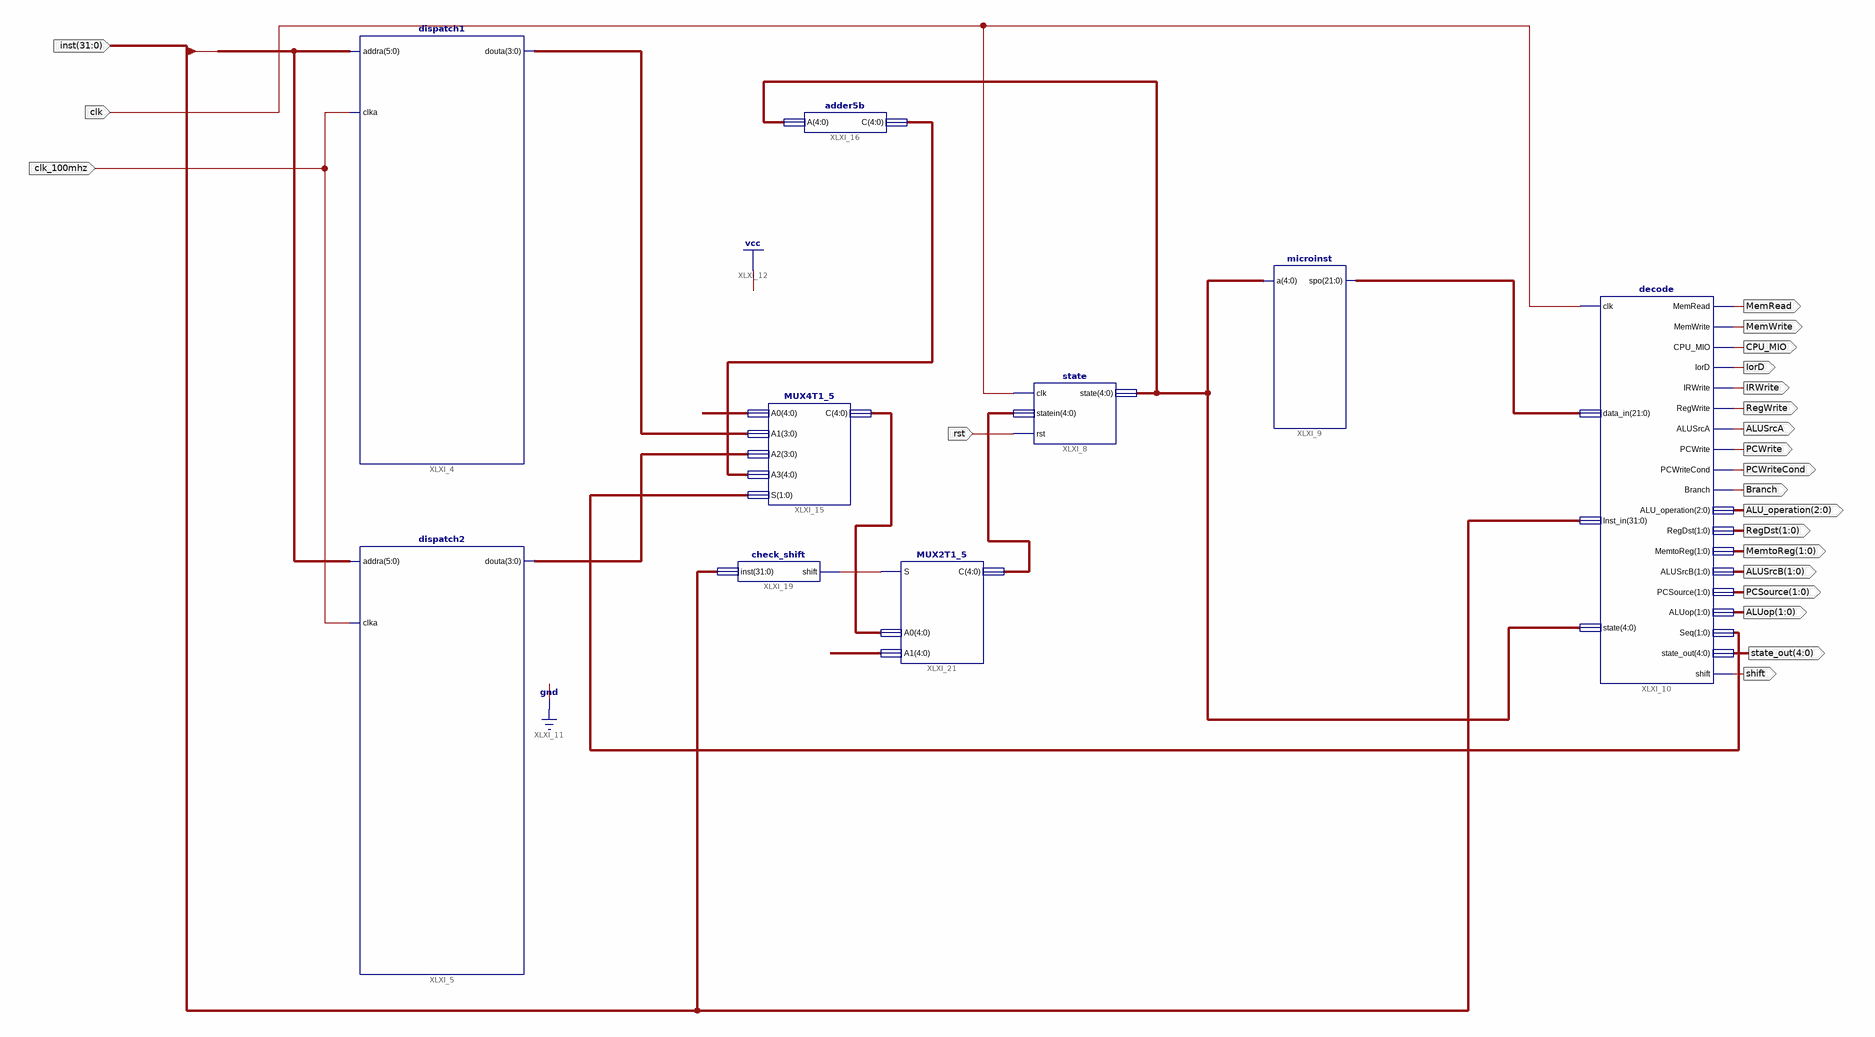
[diagram p0: schematic sheet 1]
// Xilinx ISE schematic ctrl.sch (kintex7) as structural Verilog: 9 symbols, 22 ports
module ctrl (
  input  clk,
  input  [31:0] inst,
  input  rst,
  input  clk_100mhz,
  output MemRead,
  output MemWrite,
  output CPU_MIO,
  output IorD,
  output IRWrite,
  output RegWrite,
  output ALUSrcA,
  output PCWrite,
  output PCWriteCond,
  output Branch,
  output [2:0] ALU_operation,
  output [1:0] RegDst,
  output [1:0] MemtoReg,
  output [1:0] ALUSrcB,
  output [1:0] PCSource,
  output [1:0] ALUop,
  output [4:0] state_out,
  output shift
);

  wire XLXN_44;
  wire [1:0] XLXN_37;
  wire [3:0] XLXN_7, XLXN_8;
  wire [4:0] XLXN_9, XLXN_18, XLXN_43, XLXN_48;
  wire [21:0] XLXN_20;

  dispatch1 XLXI_4 (.addra(inst[31:26]), .clka(clk_100mhz), .douta(XLXN_7));
  dispatch2 XLXI_5 (.addra(inst[31:26]), .clka(clk_100mhz), .douta(XLXN_8));
  state XLXI_8 (.clk(clk), .rst(rst), .statein(XLXN_43), .state(XLXN_18));
  microinst XLXI_9 (.a(XLXN_18), .spo(XLXN_20));
  decode XLXI_10 (
    .clk(clk), .data_in(XLXN_20), .Inst_in(inst), .state(XLXN_18), .MemRead(MemRead), .MemWrite(MemWrite),
    .CPU_MIO(CPU_MIO), .IorD(IorD), .IRWrite(IRWrite), .RegWrite(RegWrite), .ALUSrcA(ALUSrcA),
    .PCWrite(PCWrite), .PCWriteCond(PCWriteCond), .Branch(Branch), .ALU_operation(ALU_operation),
    .RegDst(RegDst), .MemtoReg(MemtoReg), .ALUSrcB(ALUSrcB), .PCSource(PCSource), .ALUop(ALUop),
    .Seq(XLXN_37), .state_out(state_out), .shift(shift));
  MUX4T1_5 XLXI_15 (.A0({5{1'b0}}), .A1(XLXN_7), .A2(XLXN_8), .A3(XLXN_9), .S(XLXN_37), .C(XLXN_48));
  adder5b XLXI_16 (.A(XLXN_18), .C(XLXN_9));
  check_shift XLXI_19 (.inst(inst), .shift(XLXN_44));
  MUX2T1_5 XLXI_21 (.S(XLXN_44), .C(XLXN_43), .A0(XLXN_48), .A1(5'b10000));
endmodule
